# EAGLE design control board (EAGLE 5.06)
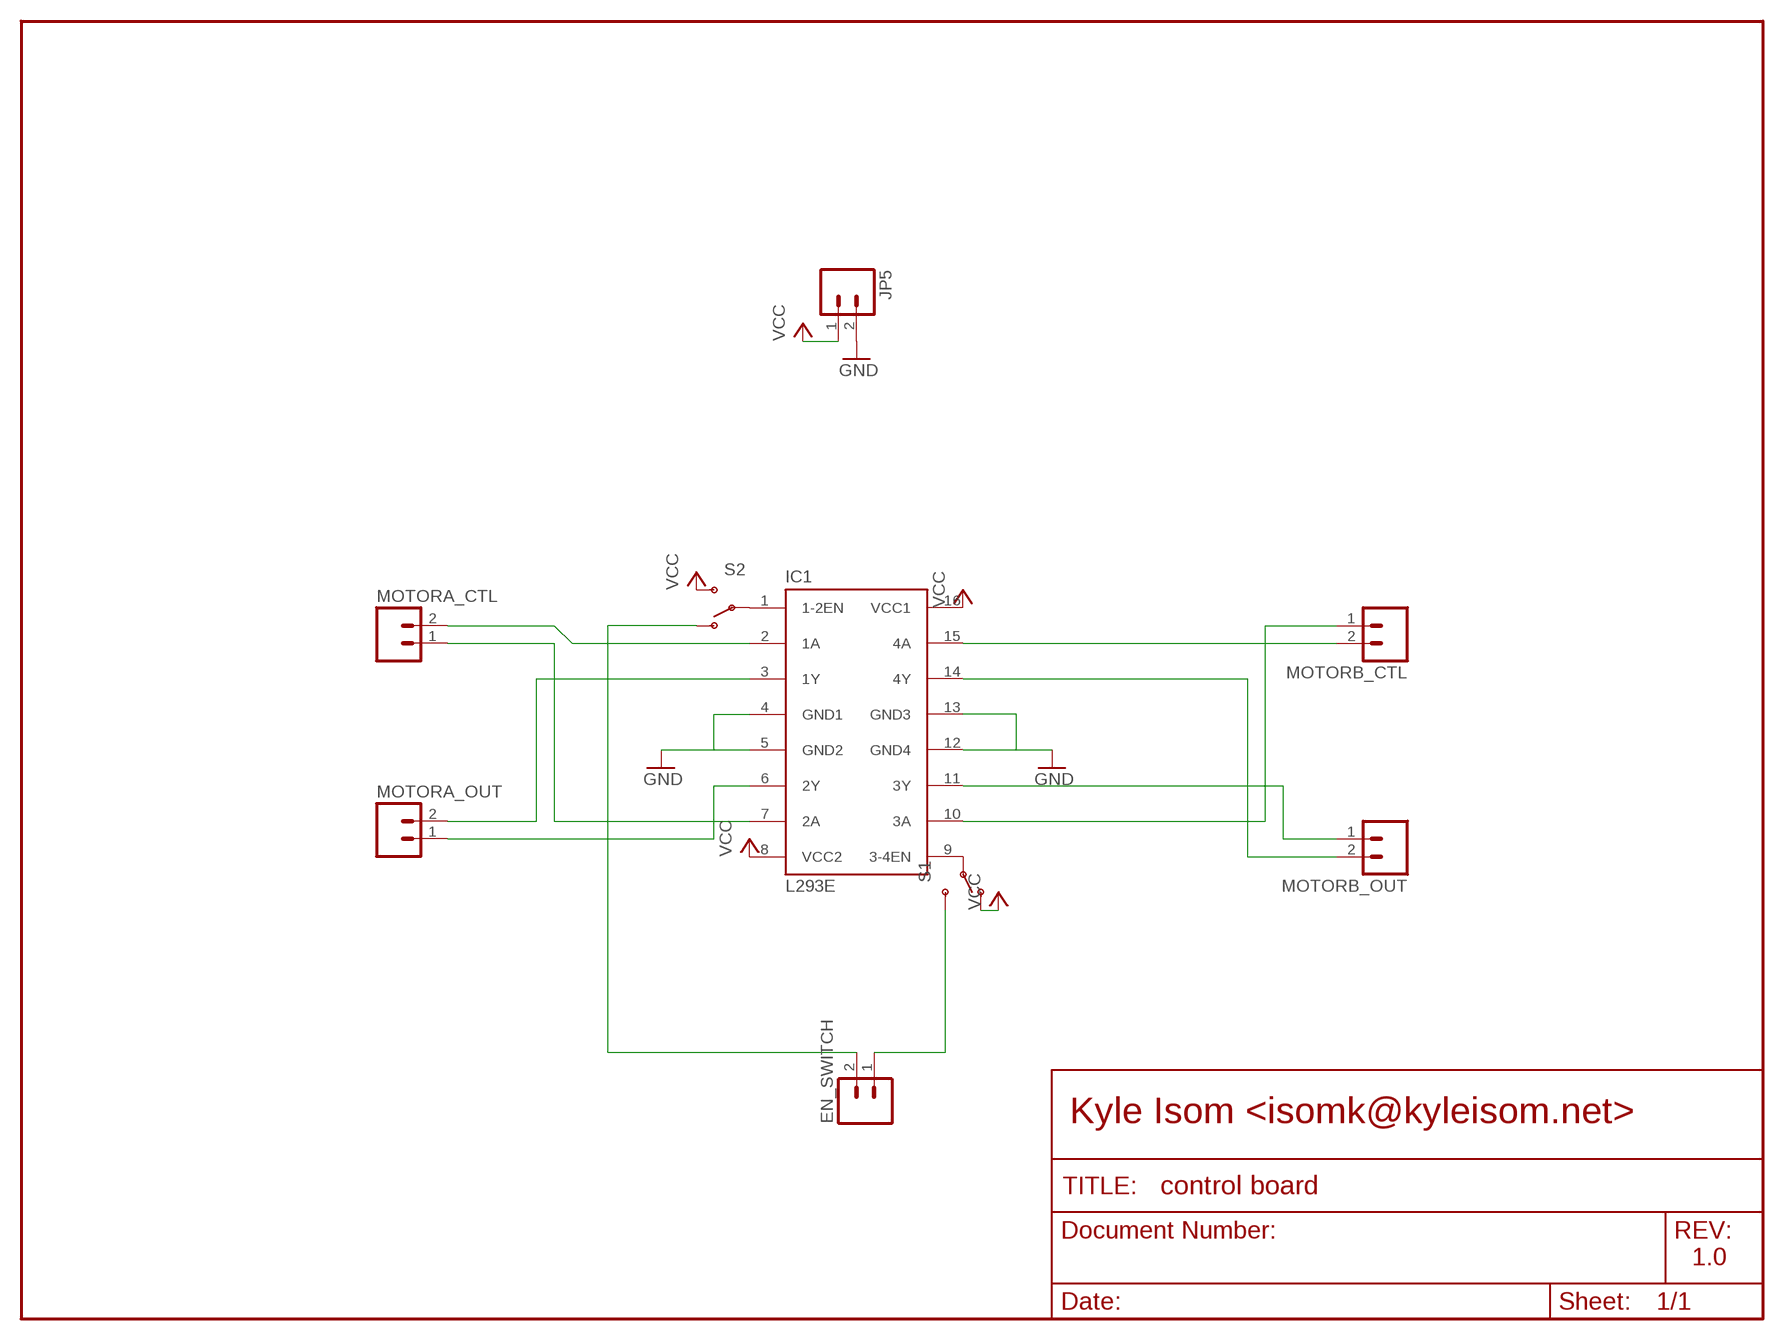
[diagram p0: schematic, sheet 1]

## Parts
EN_SWITCH  M02LOCK  [1X02_LOCK]
IC1  L293E  [DIL16]
JP5  M02-JST-2MM-SMT  [S2B-PH]
MOTORA_CTL  M02LOCK  [1X02_LOCK]
MOTORA_OUT  M02LOCK  [1X02_LOCK]
MOTORB_CTL  M02LOCK  [1X02_LOCK]
MOTORB_OUT  M02LOCK  [1X02_LOCK]
S1  SWITCH-SPSTPTH_LOCK  [SWITCH-SPDT_LOCK.007S]
S2  SWITCH-SPSTPTH_LOCK  [SWITCH-SPDT_LOCK.007S]

## Nets
GND: IC1.4(GND1) IC1.5(GND2) IC1.12(GND4) IC1.13(GND3) JP5.2
N$1: IC1.2(1A) MOTORA_CTL.2
N$2: IC1.3(1Y) MOTORA_OUT.2
N$3: IC1.7(2A) MOTORA_CTL.1
N$4: IC1.6(2Y) MOTORA_OUT.1
N$5: IC1.10(3A) MOTORB_CTL.1
N$6: IC1.15(4A) MOTORB_CTL.2
N$7: IC1.14(4Y) MOTORB_OUT.2
N$8: IC1.11(3Y) MOTORB_OUT.1
N$9: IC1.1(1-2EN) S2.2(P)
N$10: IC1.9(3-4EN) S1.2(P)
N$11: EN_SWITCH.1 S1.3(S)
N$12: EN_SWITCH.2 S2.1(O)
VCC: IC1.8(VCC2) IC1.16(VCC1) JP5.1 S1.1(O) S2.3(S)

## Notes on the sheet
- Kyle Isom <isomk@kyleisom.net>
- 1.0

## Library data of the parts
EN_SWITCH JP5 MOTORA_CTL MOTORA_OUT MOTORB_CTL MOTORB_OUT = SparkFun:M02: Header 2 Standard 2-pin 0.1" header. Use with straight break away headers (SKU : PRT-00116), right angle break away headers (PRT-00553), swiss pins (PRT-00743), machine pins (PRT-00117), and female headers (PRT-00115). Molex polarized connector foot print use with SKU : PRT-08233 with associated crimp pins and housings.
IC1 = texas:L293E: TI DEVICE
S1 S2 = SparkFun:SWITCH-SPST: SPST Switch Simple slide switch. Spark Fun Electronics SKU : COM-00102

## Board
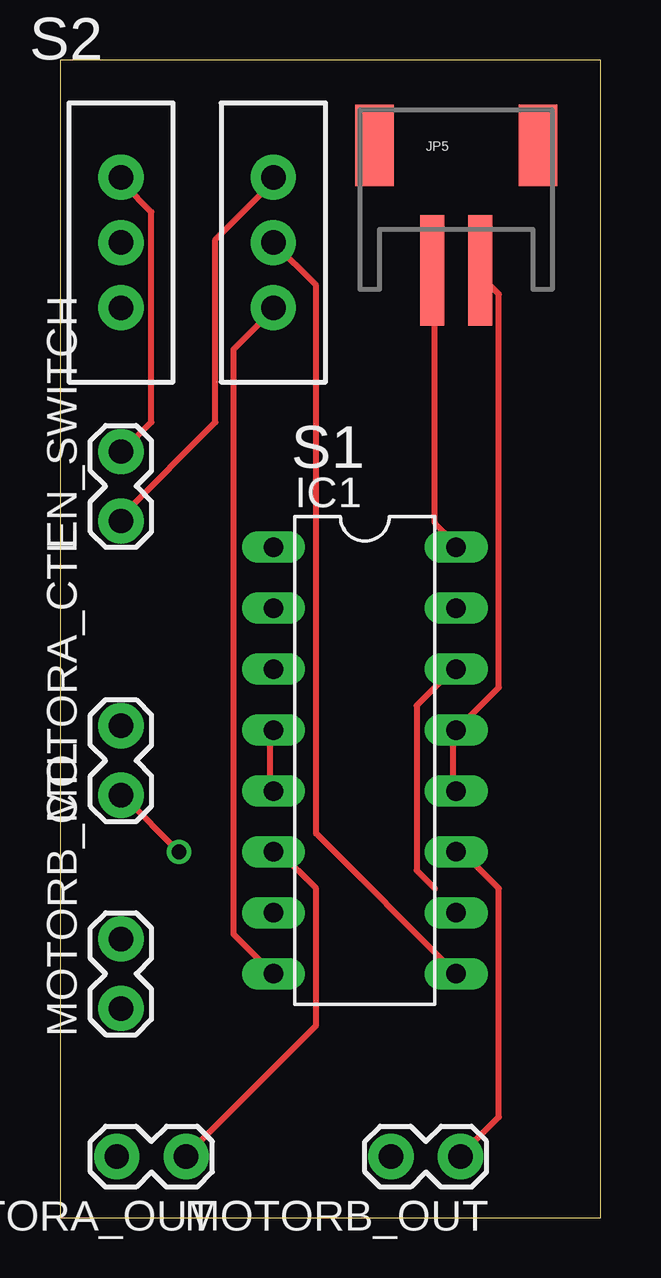
[diagram p1: board, top side]
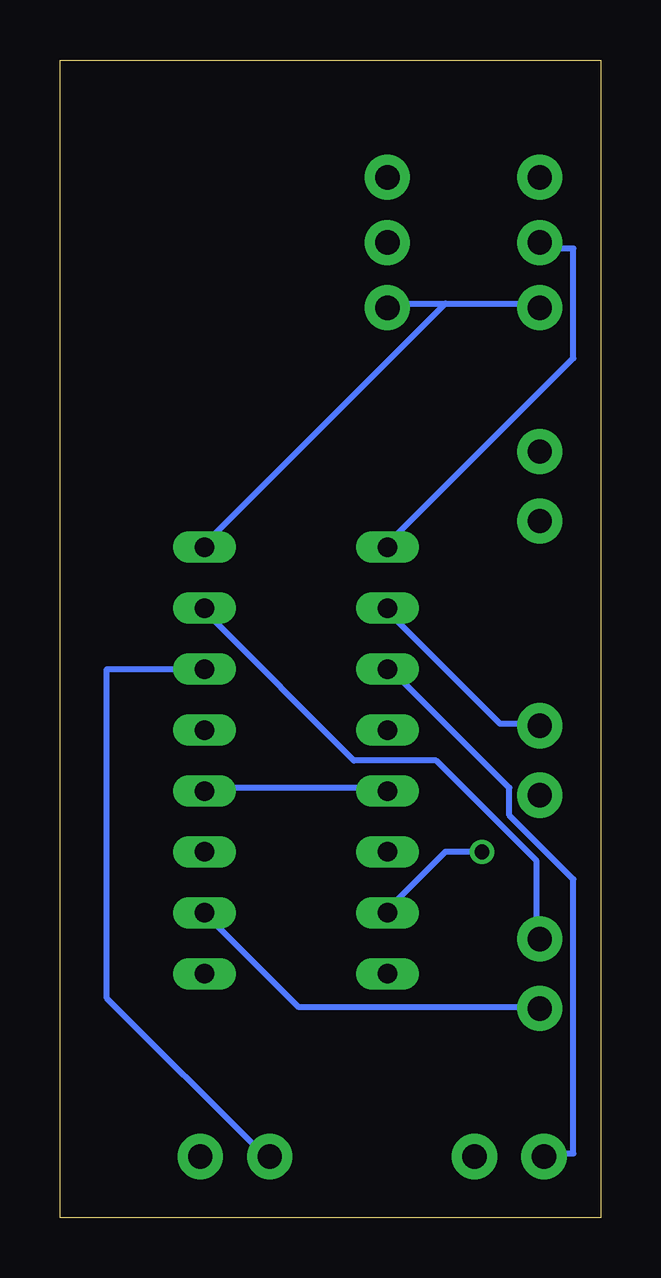
[diagram p2: board, bottom side, seen from below]

Size 22.53 x 48.25 mm. Coordinates in mm from the lower left corner, seen from the top.
Outline: 0,0 22.53,0 22.53,48.25 0,48.25 0,0
Copper layers (1*16): Top 0.035mm / dielectric 1.5mm / Bottom 0.035mm
Design rules "default": minimum track width 10mil, minimum drill 24mil, track to track 8mil, track to pad 8mil, pad to pad 8mil, via to via 8mil, smd to smd 8mil, copper to edge 40mil, drill to drill 8mil, minimum pad ring 10mil, minimum via ring 8mil, stop-mask expansion 4mil, vias tented up to drill 0mil, thermal gap 10mil

### Footprints (pad centres in the part's own frame; a part is rotated, then mirrored left to right if it is on the bottom)
1X02_LOCK = drill 1.016 pad 1.88 round: 1 -0.178,0; 2 2.718,0
DIL16 = drill 0.813 long: 1 -8.89,-3.81; 2 -6.35,-3.81; 3 -3.81,-3.81; 4 -1.27,-3.81; 5 1.27,-3.81; 6 3.81,-3.81; 7 6.35,-3.81; 8 8.89,-3.81; 9 8.89,3.81; 10 6.35,3.81; 11 3.81,3.81; 12 1.27,3.81; 13 -1.27,3.81; 14 -3.81,3.81; 15 -6.35,3.81; 16 -8.89,3.81
S2B-PH = smd 1 x 4.6: 1 -1,-3.7; 2 1,-3.7 | smd 1.6 x 3.4: NC1 -3.4,1.5; NC2 3.4,1.5
SWITCH-SPDT_LOCK.007S = drill 1.016 pad 1.88 round: 1 0,2.718; 2 0,0; 3 0,-2.718

### Placement (x,y rotation side)
EN_SWITCH  2.54,29.21 90 top
IC1  12.7,19.05 270 top
JP5  16.51,43.18 0 top
MOTORA_CTL  2.54,17.78 90 top
MOTORA_OUT  5.08,2.54 180 top
MOTORB_CTL  2.54,8.89 90 top
MOTORB_OUT  16.51,2.54 180 top
S1  8.89,40.64 180 top
S2  2.54,40.64 0 top

### Tracks (layer width: path | path; a pad name or v marks a point on that pad's centre or on a via)
GND
  Top 0.254: IC1.5 8.76,17.91 8.76,20.19 IC1.4 | IC1.12 16.38,17.91 16.38,20.19 IC1.13 18.29,22.1 18.29,38.48 17.53,39.24 JP5.2
  Bottom 0.254: IC1.5 9.14,17.91 16.38,17.91 IC1.12
N$1
  Bottom 0.254: IC1.2 8.76,25.15 4.19,20.57 2.67,20.57 MOTORA_CTL.2
N$2
  Bottom 0.254: IC1.3 8.76,22.86 3.81,17.91 3.81,16.76 1.14,14.1 1.14,2.67 2.29,2.67 MOTORA_OUT.2
N$3  (via drill 0.61)
  Top 0.254: v4.95,15.24 2.67,17.53 MOTORA_CTL.1
  Bottom 0.254: v4.95,15.24 6.48,15.24 8.76,12.95 IC1.7
N$4
  Top 0.254: IC1.6 9.14,15.24 10.67,13.72 10.67,8 5.33,2.67 MOTORA_OUT.1
N$5
  Bottom 0.254: IC1.10 12.57,8.76 2.67,8.76 MOTORB_CTL.1
N$6
  Bottom 0.254: IC1.15 16.38,25.15 10.29,19.05 6.86,19.05 2.67,14.86 2.67,11.81 MOTORB_CTL.2
N$7
  Top 0.254: 15.62,13.72 14.86,14.48 14.86,21.34 16.38,22.86 IC1.14
  Bottom 0.254: MOTORB_OUT.2 14.1,2.67 20.57,9.14 20.57,22.86 IC1.14
N$8
  Top 0.254: IC1.11 16.76,15.24 18.29,13.72 18.29,4.19 16.76,2.67 MOTORB_OUT.1
  Bottom 0.254: IC1.11 16.76,15.24
N$9
  Bottom 0.254: IC1.1 8.76,28.19 1.14,35.81 1.14,40.39 2.29,40.39 S2.2
N$10
  Top 0.254: IC1.9 10.67,16 10.67,38.86 S1.2
N$11
  Top 0.254: EN_SWITCH.1 2.67,29.34 6.48,33.15 6.48,40.77 8.76,43.05 S1.3
N$12
  Top 0.254: EN_SWITCH.2 2.67,32 3.81,33.15 3.81,41.91 2.67,43.05 S2.1
VCC
  Top 0.254: IC1.16 16.38,28.19 15.62,28.96 15.62,39.24 JP5.1 | IC1.8 7.24,11.81 7.24,36.2 8.76,37.72 S1.1
  Bottom 0.254: 6.48,38.1 8.76,38.1 S1.1 | 6.48,38.1 2.67,38.1 S2.3 | 6.48,38.1 16.38,28.19 IC1.16